# EAGLE design RaspiLink_bk1 (EAGLE 7.2.0)
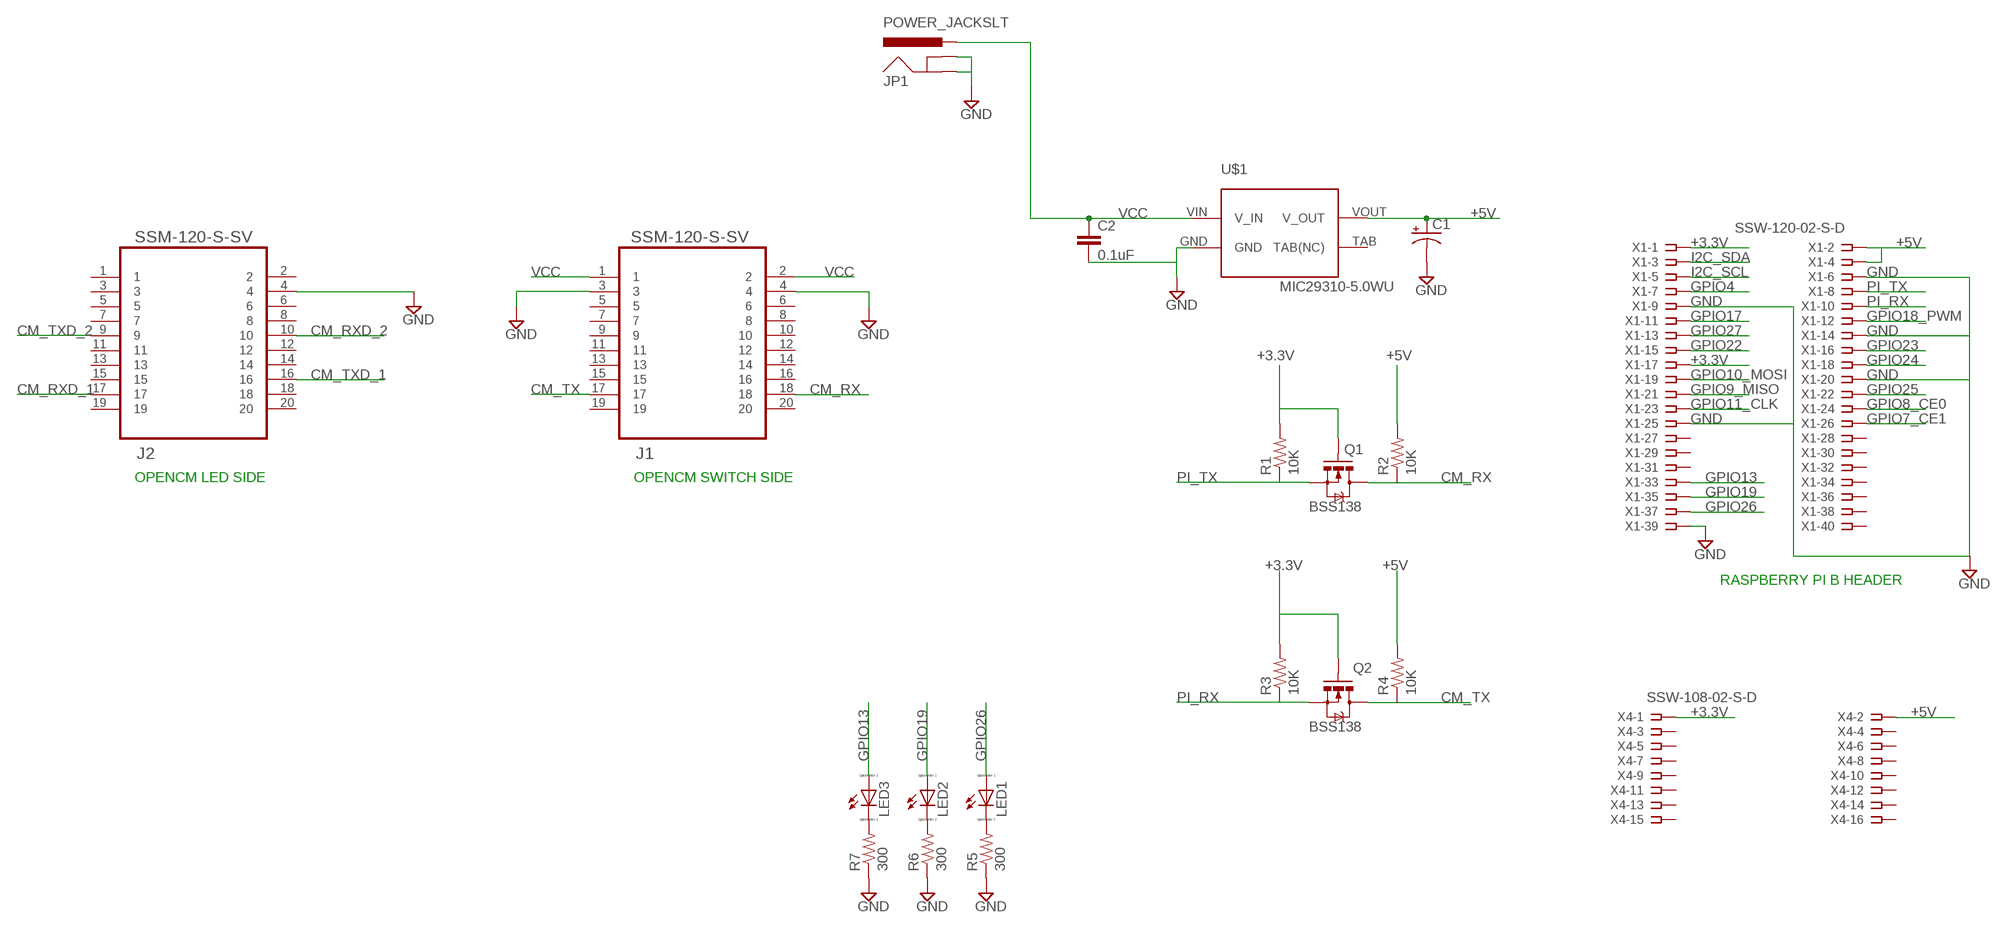
[diagram p0: schematic, sheet 1]

## Parts
C1  100UF-25V-20%(PTH)  [CPOL-RADIAL-100UF-25V]
C2  0.1uF  0.1UF-25V-5%(0603)  [0603-CAP]
J1  SSM-120-S-SV  [SAMTEC_SSM-120-S-SV]
J2  SSM-120-S-SV  [SAMTEC_SSM-120-S-SV]
JP1  POWER_JACKSLT  [POWER_JACK_SLOT]
LED1  LED_ELD260  [LED_LD260]
LED2  LED_ELD260  [LED_LD260]
LED3  LED_ELD260  [LED_LD260]
Q1  MOSFET-NCHANNELBSS123LT1G  [SOT23-3]
Q2  MOSFET-NCHANNELBSS123LT1G  [SOT23-3]
R1  10K  RESISTOR0603-RES  [0603-RES]
R2  10K  RESISTOR0603-RES  [0603-RES]
R3  10K  RESISTOR0603-RES  [0603-RES]
R4  10K  RESISTOR0603-RES  [0603-RES]
R5  300  RESISTOR0603-RES  [0603-RES]
R6  300  RESISTOR0603-RES  [0603-RES]
R7  300  RESISTOR0603-RES  [0603-RES]
U$1  MIC29310-5.0WU  [TO-263-3]
X1  SSW-120-02-S-D  [SSW-120-02-S-D]
X4  SSW-108-02-S-D  [SSW-108-02-S-D]

## Nets
+3.3V: Q1.1(G) Q2.1(G) R1.2 R3.2 X1.1 X1.17 X4.1
+5V: C1.1(+) R2.2 R4.2 U$1.VOUT(V_OUT) X1.2 X1.4 X4.2
CM_RX: J1.18 Q1.3(D) R2.1
CM_RXD_1: J2.17
CM_RXD_2: J2.10
CM_TX: J1.17 Q2.3(D) R4.1
CM_TXD_1: J2.16
CM_TXD_2: J2.9
GND: C1.2(-) C2.2 J1.3 J1.4 J2.4 JP1.GND@1(GNDBREAK) JP1.GND@2(GND) R5.1 R6.1 R7.1 U$1.GND X1.6 X1.9 X1.14 X1.20 X1.25 X1.39
GPIO4: X1.7
GPIO7_CE1: X1.26
GPIO8_CE0: X1.24
GPIO9_MISO: X1.21
GPIO10_MOSI: X1.19
GPIO11_CLK: X1.23
GPIO13: LED3.A X1.33
GPIO17: X1.11
GPIO18_PWM: X1.12
GPIO19: LED2.A X1.35
GPIO22: X1.15
GPIO23: X1.16
GPIO24: X1.18
GPIO25: X1.22
GPIO26: LED1.A X1.37
GPIO27: X1.13
I2C_SCL: X1.5
I2C_SDA: X1.3
N$17: LED1.K(C) R5.2
N$18: LED2.K(C) R6.2
N$19: LED3.K(C) R7.2
PI_RX: Q2.2(S) R3.1 X1.10
PI_TX: Q1.2(S) R1.1 X1.8
VCC: C2.1 J1.1 J1.2 JP1.PWR U$1.VIN(V_IN)
Unconnected: J1.5 J1.6 J1.7 J1.8 J1.9 J1.10 J1.11 J1.12 J1.13 J1.14 J1.15 J1.16 J1.19 J1.20 J2.1 J2.2 J2.3 J2.5 J2.6 J2.7 J2.8 J2.11 J2.12 J2.13 J2.14 J2.15 J2.18 J2.19 J2.20 U$1.TAB(TAB(NC)) X1.27 X1.28 X1.29 X1.30 X1.31 X1.32 X1.34 X1.36 X1.38 X1.40 X4.3 X4.4 X4.5 X4.6 X4.7 X4.8 X4.9 X4.10 X4.11 X4.12 X4.13 X4.14 X4.15 X4.16

## Notes on the sheet
- OPENCM LED SIDE | OPENCM SWITCH SIDE
- RASPBERRY PI B HEADER

## Library data of the parts
C1 = SparkFun-Capacitors:100UF-25V-20%(PTH): CAP-08439; PROD_ID: CAP-08439
C2 = SparkFun-Capacitors:0.1UF-25V-5%(0603): CAP-08604; PROD_ID: CAP-08604
J1 J2 = SAMTEC-FLE-Mxx-Sxx_By_element14_Batch_1:SSM-120-S-SV: .025 SOCKET STRIPS , 20POS; MPN: SSM-120-S-SV; OC_FARNELL: -; OC_NEWARK: 11P7987; PACKAGE: .025 SOCKET STRIPS , 20POS; SUPPLIER: SAMTEC
JP1 = SparkFun-Connectors:POWER_JACK: Power Jack This is the standard 5.5mm barrel jack for power. The PTH is the most common, proven, reliable, footprint. The Slot footprint only works if the mill layer is transmitted to the PCB fab house so be warned. Mating wall wart : TOL-00298 (and others); PROD_ID: PRT-00119
LED1-LED3 = eagle-ltspice:LED_E: LED Source: http://www.osram.convergy.de Source: www.luxeon.com Source: www.kingbright.com; SPICEMODEL: NONE; SPICEPREFIX: D; SPICETYPE: diode
Q1 Q2 = SparkFun-DiscreteSemi:MOSFET-NCHANNEL: Common NMOSFET Parts MFG P/N Store ID Prod ID FDD8780 TRANS-09984 SI7820DN TRANS-11055 FDS6630A IC-08089 2N7002PW TRANS-11151 FQP30N06L COM-10213 TRANS-10060 BSS123LT1G TRANS-08345 BSS138 TRANS-00830 BS170 2N7000; PROD_ID: BSS138
R1-R7 = SparkFun-Passives:RESISTOR: Resistor Basic schematic elements and footprints for 0603, 1206, and PTH resistors.
U$1 = Micrel_By_element14_Batch_1:MIC29310-5.0WU
X1 = con-samtec:SSW-120-02-S-D: THROUGH-HOLE .025" SQ POST SOCKET Source: Samtec SSW.pdf; MPN: SSW-120-02-S-D; OC_FARNELL: unknown; OC_NEWARK: 11P9639
X4 = con-samtec:SSW-108-02-S-D: THROUGH-HOLE .025" SQ POST SOCKET Source: Samtec SSW.pdf; MPN: SSW-108-02-S-D; OC_FARNELL: unknown; OC_NEWARK: 85K7646

## Board
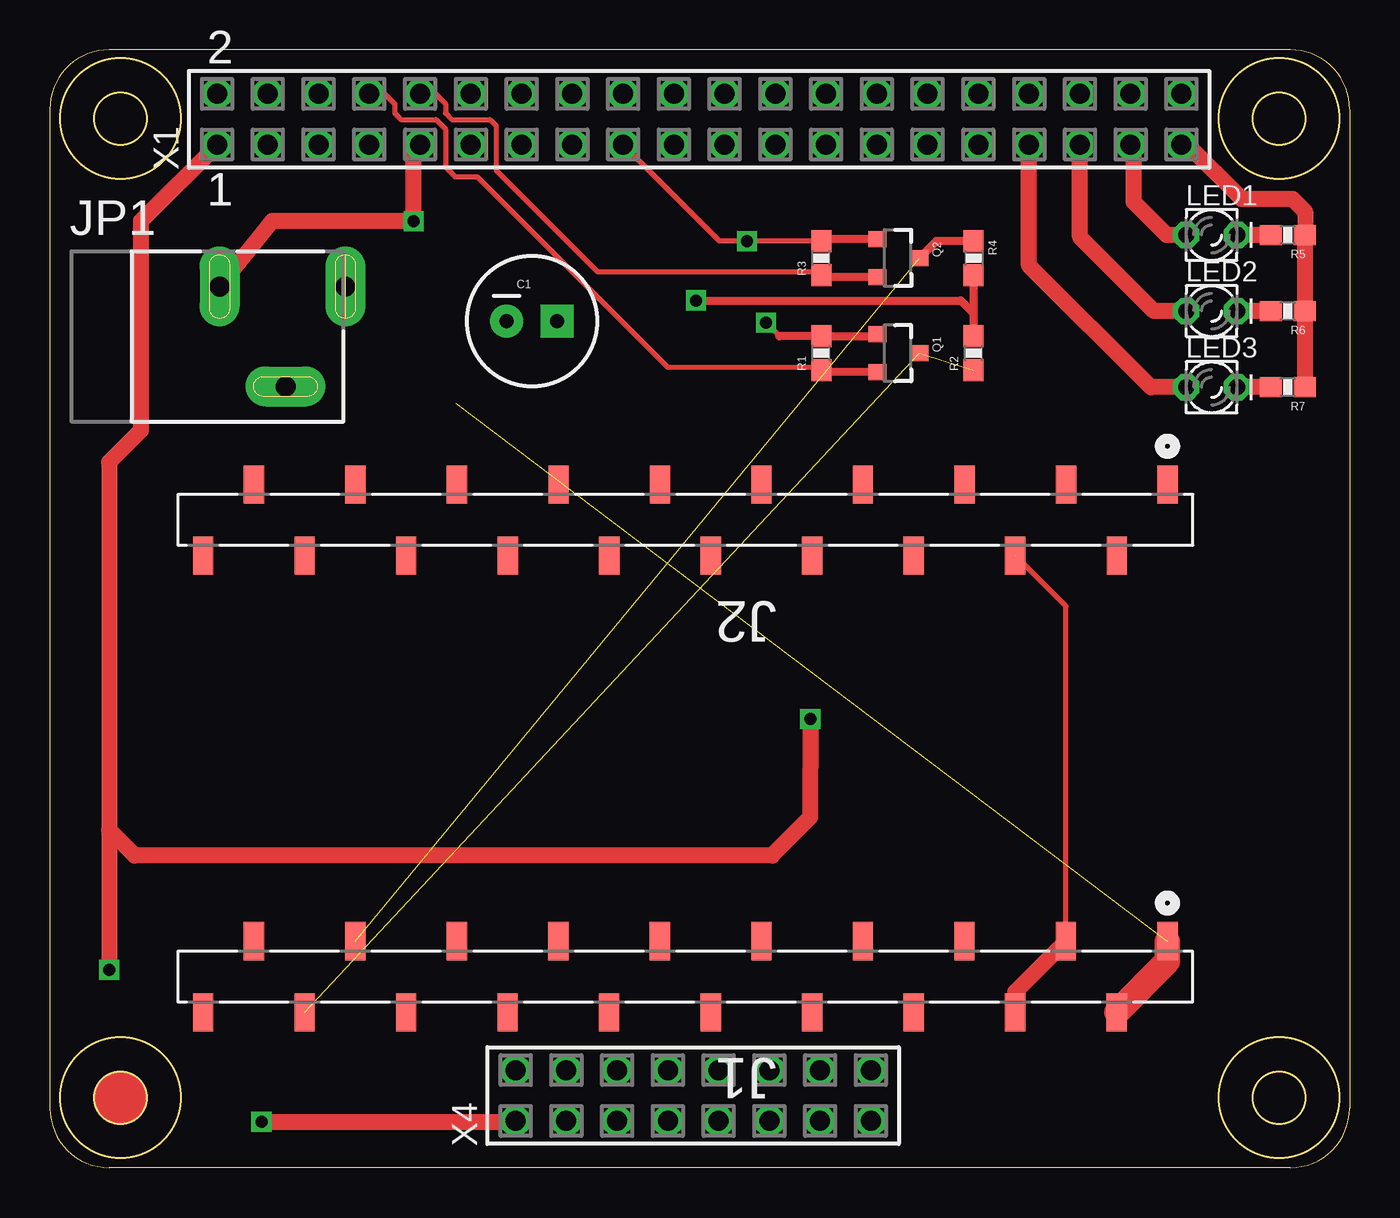
[diagram p1: board, top side]
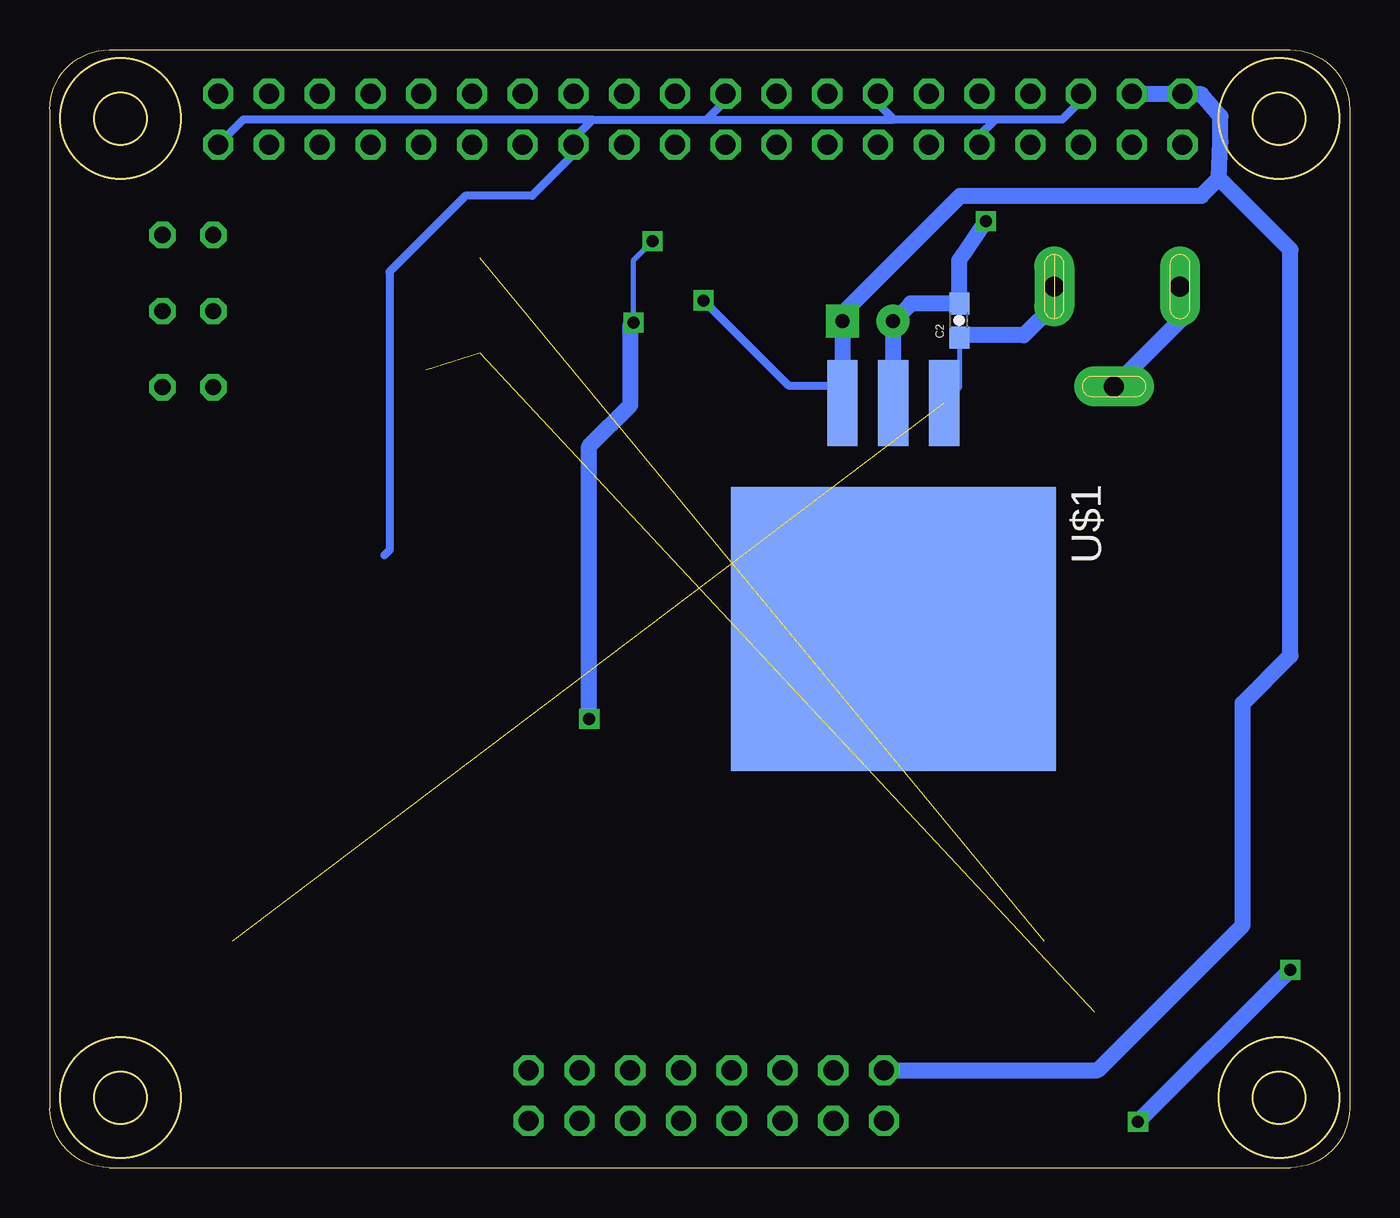
[diagram p2: board, bottom side, seen from below]

Size 65.04 x 55.94 mm. Coordinates in mm from the lower left corner, seen from the top.
Outline: 0,52.94 0,2.97 arc90 2.96,0 62.07,0 arc90 65.04,2.97 65.04,52.94
Outline: 0,52.97 arc-90 2.96,55.94 62.07,55.94 arc-90 65.04,52.97
Outline: circle at 3.54,3.5 radius 3.01
Outline: circle at 3.53,3.5 radius 1.3
Outline: circle at 3.54,52.5 radius 3.01
Outline: circle at 3.53,52.5 radius 1.3
Outline: circle at 61.52,3.5 radius 3.01
Outline: circle at 61.51,3.5 radius 1.3
Outline: circle at 61.51,52.5 radius 1.3
Outline: circle at 61.52,52.5 radius 3.01
Copper layers (1*16): Top 0.035mm / dielectric 1.5mm / Bottom 0.035mm
Design rules "default": minimum track width 10mil, minimum drill 24mil, track to track 8mil, track to pad 8mil, pad to pad 8mil, via to via 8mil, smd to smd 8mil, copper to edge 40mil, drill to drill 8mil, minimum pad ring 10mil, minimum via ring 8mil, stop-mask expansion 4mil, vias tented up to drill 0mil, thermal gap 10mil

### Footprints (pad centres in the part's own frame; a part is rotated, then mirrored left to right if it is on the bottom)
CPOL-RADIAL-100UF-25V = drill 0.7 pad 1.651 square: 1 1.27,0 | drill 0.7 pad 1.651: 2 -1.27,0
0603-CAP = smd 1.1 x 1: 1 -0.85,0; 2 0.85,0
SAMTEC_SSM-120-S-SV = smd 1.016 x 1.905: 1 0,0; 2 2.54,3.556; 3 5.08,0; 4 7.62,3.556; 5 10.16,0; 6 12.7,3.556; 7 15.24,0; 8 17.78,3.556; 9 20.32,0; 10 22.86,3.556; 11 25.4,0; 12 27.94,3.556; 13 30.48,0; 14 33.02,3.556; 15 35.56,0; 16 38.1,3.556; 17 40.64,0; 18 43.18,3.556; 19 45.72,0; 20 48.26,3.556
POWER_JACK_SLOT = drill 1 pad 2 long: GND@1 2.58,7.5; GND@2 7.58,10.8; PWR 2.58,13.8
LED_LD260 = drill 0.813 octagon: A -1.27,0; K 1.27,0
SOT23-3 = smd 0.8 x 0.9: 1 -0.95,-1; 2 0.95,-1; 3 0,1.1
0603-RES = smd 1.1 x 1: 1 -0.85,0; 2 0.85,0
TO-263-3 = smd 4.318 x 1.524: GND -5.969,0; VIN -5.969,2.54; VOUT -5.969,-2.54 | smd 14.224 x 16.256: TAB 5.334,0
SSW-120-02-S-D = drill 1 pad 1.5 octagon: 1 -24.13,-1.27; 2 -24.13,1.27; 3 -21.59,-1.27; 4 -21.59,1.27; 5 -19.05,-1.27; 6 -19.05,1.27; 7 -16.51,-1.27; 8 -16.51,1.27; 9 -13.97,-1.27; 10 -13.97,1.27; 11 -11.43,-1.27; 12 -11.43,1.27; 13 -8.89,-1.27; 14 -8.89,1.27; 15 -6.35,-1.27; 16 -6.35,1.27; 17 -3.81,-1.27; 18 -3.81,1.27; 19 -1.27,-1.27; 20 -1.27,1.27; 21 1.27,-1.27; 22 1.27,1.27; 23 3.81,-1.27; 24 3.81,1.27; 25 6.35,-1.27; 26 6.35,1.27; 27 8.89,-1.27; 28 8.89,1.27; 29 11.43,-1.27; 30 11.43,1.27; 31 13.97,-1.27; 32 13.97,1.27; 33 16.51,-1.27; 34 16.51,1.27; 35 19.05,-1.27; 36 19.05,1.27; 37 21.59,-1.27; 38 21.59,1.27; 39 24.13,-1.27; 40 24.13,1.27
SSW-108-02-S-D = drill 1 pad 1.5 octagon: 1 -8.89,-1.27; 2 -8.89,1.27; 3 -6.35,-1.27; 4 -6.35,1.27; 5 -3.81,-1.27; 6 -3.81,1.27; 7 -1.27,-1.27; 8 -1.27,1.27; 9 1.27,-1.27; 10 1.27,1.27; 11 3.81,-1.27; 12 3.81,1.27; 13 6.35,-1.27; 14 6.35,1.27; 15 8.89,-1.27; 16 8.89,1.27

### Placement (x,y rotation side)
C1  24.12,42.35 0 top
C2  19.53,42.4 90 bottom
J1  55.92,11.34 180 top
J2  55.93,34.2 180 top
JP1  0.98,46.68 270 top
LED1  58.13,46.68 0 top
LED2  58.13,42.87 0 top
LED3  58.13,39.06 0 top
Q1  42.41,40.76 270 top
Q2  42.41,45.52 270 top
R1  38.6,40.76 90 top
R2  46.22,40.76 90 top
R3  38.6,45.52 90 top
R4  46.22,45.52 270 top
R5  61.94,46.68 180 top
R6  61.94,42.87 180 top
R7  61.94,39.06 180 top
U$1  22.84,32.29 270 bottom
X1  32.49,52.47 0 top
X4  32.19,3.61 0 top

### Tracks (layer width: path | path; a pad name or v marks a point on that pad's centre or on a via)
+3.3V  (via drill 0.6)
  Top 0.254: 38.7,46.47 R3.2 v34.87,46.37 33.5,46.37 X1.17 | 36.5,41.61 v35.83,42.29
  Top 0.406: Q2.1 38.7,46.47 | 36.5,41.61 R1.2 41.31,41.61 Q1.1
  Top 0.61: X1.1 8.36,51.18
  Top 0.813: 8.36,51.18 4.55,47.37 4.55,36.89 2.96,35.31 2.96,16.89 | 2.96,16.89 v2.96,9.91 | v10.58,2.29 23.25,2.29 X4.1 | 2.96,16.89 4.23,15.62 36.14,15.62 38.04,17.53 v38.05,22.45
  Bottom 0.254: v35.83,42.29 35.83,45.42 v34.87,46.37
  Bottom 0.813: v2.96,9.91 v10.58,2.29 | v38.05,22.45 38.05,36.1 35.98,38.16 35.98,42.13 v35.83,42.29
+5V  (via drill 0.6)
  Top 0.406: R4.2 46.22,42.77 | 46.22,42.77 R2.2 | v32.33,43.4 45.59,43.4 46.22,42.77
  Bottom 0.406: 25.51,39.12 28.05,39.12 v32.33,43.4
  Bottom 0.813: C1.1 25.39,39.56 25.51,39.12 | C1.1 25.39,38.27 U$1.VOUT | X1.4 X1.2 8.34,53.72 7.41,53.72 6.46,52.61 6.46,51.34 6.54,49.51 | C1.1 25.39,42.73 19.47,48.64 7.41,48.64 6.54,49.51 | X4.2 12.6,4.88 5.35,12.13 5.35,23.24 2.96,25.62 2.96,45.94 6.54,49.51
CM_RX  (2 unrouted)
CM_TX  (1 unrouted)
  Top 0.406: R4.1 44.36,46.37 Q2.3
GND  (via drill 0.6)  (1 unrouted)
  Top 0.254: J1.3 50.84,28.11 J2.4
  Top 0.813: JP1.GND@1 11.12,47.37 v18.2,47.37 18.2,50.89 X1.9 | R7.1 R6.1 R5.1 62.81,46.7 62.81,47.85 62.18,48.48 59.64,48.48 56.92,51.2 X1.39 | J1.4 48.3,8.8 J1.3
  Bottom 0.406: X1.6 13.44,53.41 14.39,52.45 17.73,52.45 | 17.73,52.45 22.81,52.45 | X1.9 18.52,51.66 17.73,52.45 | X1.14 23.6,53.24 22.81,52.45 | 37.89,52.45 38.84,51.5 X1.25 38.84,50.71 40.91,48.64 44.24,48.64 48.05,44.83 48.05,30.9 J2.4 | 37.89,52.45 32.17,52.45 | 32.17,52.45 22.81,52.45 | X1.20 31.22,53.41 32.17,52.45 | 37.89,52.45 55.37,52.45 X1.39
  Bottom 0.813: JP1.GND@2 8.48,42.4 JP1.GND@1 | U$1.GND 22.85,38.27 C1.2 21.95,43.25 C2.2 19.53,45.41 v18.2,47.37
GPIO13
  Top 0.813: LED3.A 55.09,39.06 49,45.15 X1.33
GPIO19
  Top 0.813: LED2.A 55.25,42.87 51.54,46.58 X1.35
GPIO26
  Top 0.813: LED1.A 55.89,46.68 54.24,48.32 54.24,51.04 X1.37
N$17
  Top 0.813: R5.2 LED1.K
N$18
  Top 0.813: R6.2 LED2.K
N$19
  Top 0.813: R7.2 LED3.K
PI_RX
  Top 0.254: X1.10 19.3,53.74 19.79,53.25 19.79,52.77 20.11,52.45 22.01,52.45 22.33,52.13 22.33,49.91 27.41,44.83 38.44,44.83 R3.1
  Top 0.406: Q2.2 38.7,44.57 R3.1
PI_TX
  Top 0.254: X1.8 16.76,53.74 17.25,53.25 17.25,52.77 17.57,52.45 19.32,52.45 19.79,51.98 19.79,50.07 20.27,49.59 21.38,49.59 30.9,40.07 38.44,40.07 R1.1
  Top 0.406: Q1.2 38.7,39.81 R1.1
VCC  (1 unrouted)
  Top 1.27: J1.1 55.92,10.32 J1.2
  Bottom 0.254: C2.1 19.53,39.02 U$1.VIN
  Bottom 0.813: JP1.PWR 14.78,43.17 16.3,41.66 19.43,41.66 C2.1
(copper drawn outside any net)
  shapes: Top circle x1